# EAGLE design TRV_ANAREN_V0.5 (EAGLE 6.3)
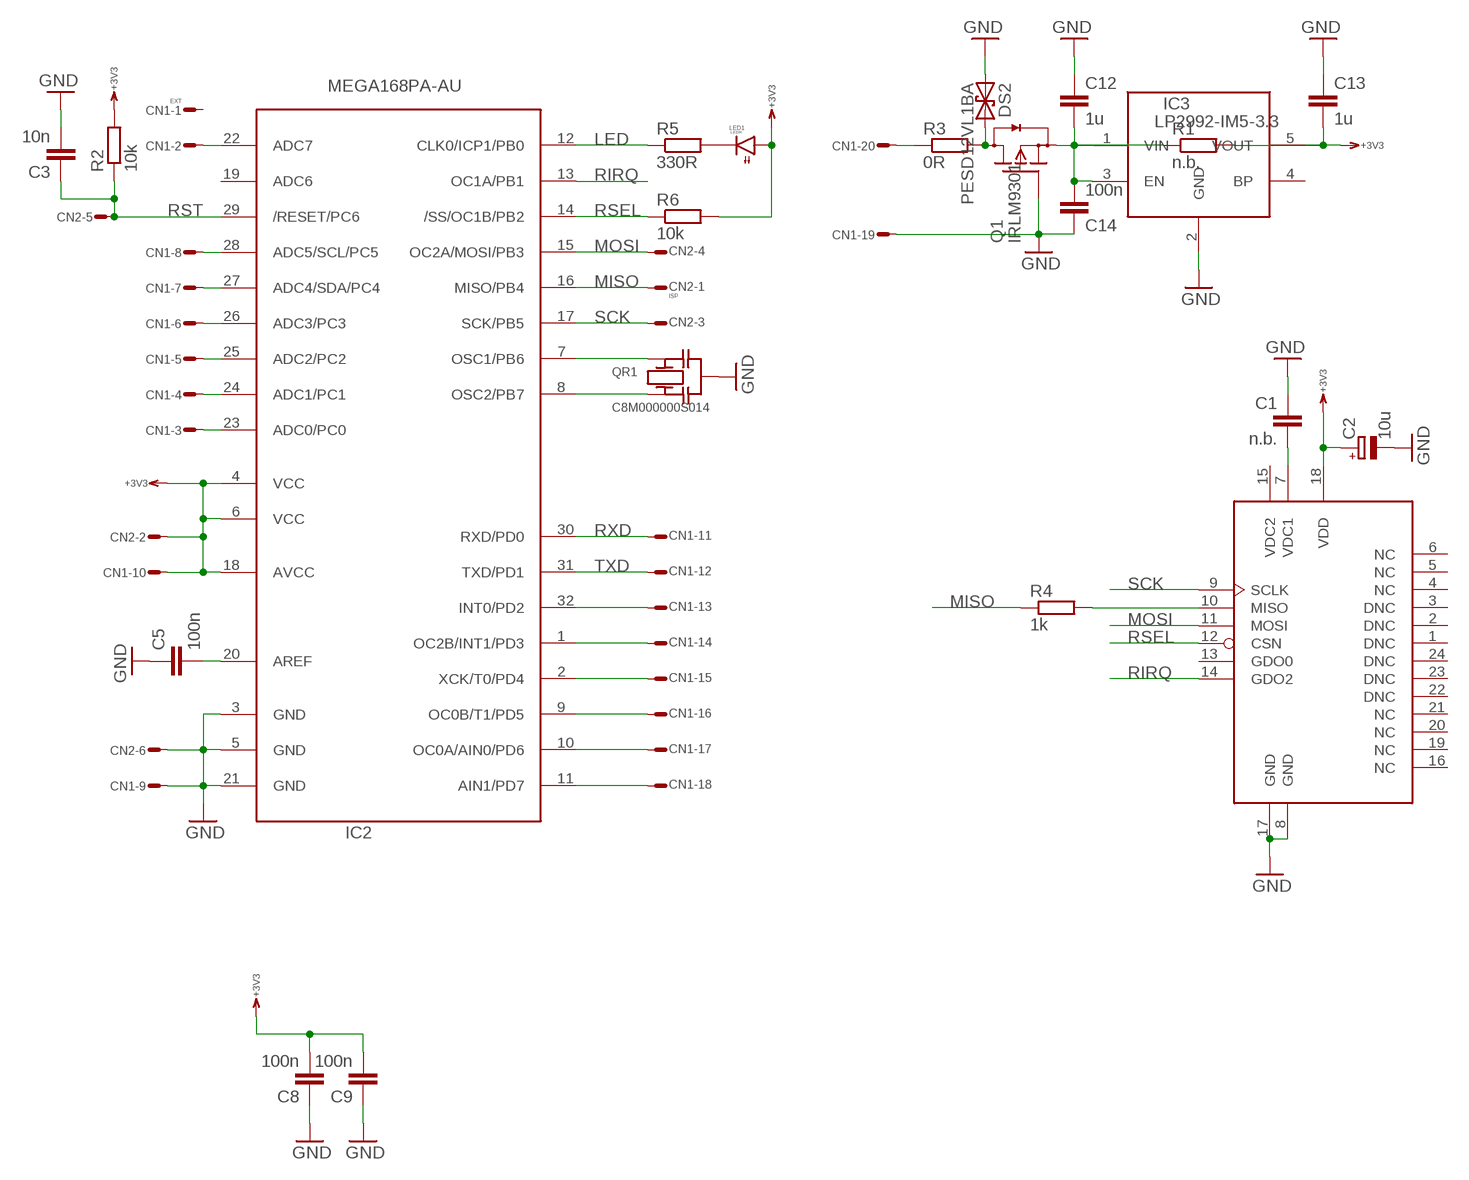
[diagram p0: schematic, sheet 1]

## Parts
C1  n.b.  C0603  [0603]
C2  10u  C_POLSMCB  [SMC_B]
C3  10n  C0603  [0603]
C5  100n  C0603  [0603]
C8  100n  C0603  [0603]
C9  100n  C0603  [0603]
C12  1u  C0603  [0603]
C13  1u  C0603  [0603]
C14  100n  C0603  [0603]
CN1  EXT  ML20SE  [ML20S]
CN2  ISP  ML6ES  [ML6S]
DS2  PESD12VL1BA  TVS-U323  [SOD323]
IC2  MEGA168PA-AU  MEGA168PA  [TQFP32-08]
IC3  LP2992-IM5-3.3  LDO  [SOT23-5]
LED1  LEDR  LED0603  [0603]
Q1  IRLM9301  FET-PDSOT23  [SOT23]
QR1  C8M000000S014  QRCR  [CR]
R1  n.b.  R0603  [0603]
R2  10k  R0603  [0603]
R3  0R  R0603  [0603]
R4  1k  R0603  [0603]
R5  330R  R0603  [0603]
R6  10k  R0603  [0603]
RF1  ANARENC  [ANAREN_C]

## Nets
+3V3: C2.+ C8.2 C9.2 C13.2 CN1.10 CN2.2 IC2.4(VCC) IC2.6(VCC) IC2.18(AVCC) IC3.5(VOUT) LED1.1(A) R1.2 R2.2 R6.2 RF1.18(VDD)
GND: C1.1 C2.- C3.2 C5.1 C8.1 C9.1 C12.1 C13.1 C14.1 CN1.9 CN1.19 CN2.6 DS2.A IC2.3(GND) IC2.5(GND) IC2.21(GND) IC3.2(GND) Q1.1(G) QR1.M RF1.8(GND) RF1.17(GND)
LED: IC2.12(CLK0/ICP1/PB0) R5.1
MISO: CN2.1 IC2.16(MISO/PB4) R4.1
MOSI: CN2.4 IC2.15(OC2A/MOSI/PB3) RF1.11(MOSI)
N$1: C1.2 RF1.7(VDC1)
N$2: R4.2 RF1.10(MISO)
N$3: CN1.2 IC2.22(ADC7)
N$5: DS2.C Q1.3(D) R3.2
N$6: C5.2 IC2.20(AREF)
N$12: C12.2 C14.2 IC3.1(VIN) IC3.3(EN) Q1.2(S) R1.1
N$18: IC2.7(OSC1/PB6) QR1.2
N$19: IC2.8(OSC2/PB7) QR1.1
N$21: LED1.2(C) R5.2
PC0: CN1.3 IC2.23(ADC0/PC0)
PC1: CN1.4 IC2.24(ADC1/PC1)
PC2: CN1.5 IC2.25(ADC2/PC2)
PC3: CN1.6 IC2.26(ADC3/PC3)
PC4: CN1.7 IC2.27(ADC4/SDA/PC4)
PC5: CN1.8 IC2.28(ADC5/SCL/PC5)
PD2: CN1.13 IC2.32(INT0/PD2)
PD3: CN1.14 IC2.1(OC2B/INT1/PD3)
PD4: CN1.15 IC2.2(XCK/T0/PD4)
PD5: CN1.16 IC2.9(OC0B/T1/PD5)
PD6: CN1.17 IC2.10(OC0A/AIN0/PD6)
PD7: CN1.18 IC2.11(AIN1/PD7)
RIRQ: IC2.13(OC1A/PB1) RF1.14(GDO2)
RSEL: IC2.14(/SS/OC1B/PB2) R6.1 RF1.12(CSN)
RST: C3.1 CN2.5 IC2.29(/RESET/PC6) R2.1
RXD: CN1.11 IC2.30(RXD/PD0)
SCK: CN2.3 IC2.17(SCK/PB5) RF1.9(SCLK)
TXD: CN1.12 IC2.31(TXD/PD1)
VIN: CN1.20 R3.1
Unconnected: CN1.1 IC2.19(ADC6) IC3.4(BP) RF1.1(DNC) RF1.2(DNC) RF1.3(DNC) RF1.4(NC) RF1.5(NC) RF1.6(NC) RF1.13(GDO0) RF1.15(VDC2) RF1.16(NC) RF1.19(NC) RF1.20(NC) RF1.21(NC) RF1.22(DNC) RF1.23(DNC) RF1.24(DNC)

## Library data of the parts
C1 C3 C5 C8 C9 C12-C14 = RCL:C: Capacitor SMD
C2 = RCL:C_POL: POLARIZED CAPACITOR, European symbol
CN1 = Conn:ML20?E: HARTING
CN2 = Conn:ML6E: HARTING
DS2 = Diode:TVS-U: DIODE
IC2 = atmel:MEGA168P: MCU, 4/8/16k, TQFP32
IC3 = DCDC:LDO
LED1 = Optic:LED
Q1 = Transistor:FET-PD
QR1 = QUARTZ:QR
R1-R6 = RCL:R: Resistor SMD
RF1 = RF:ANAREN

## Board
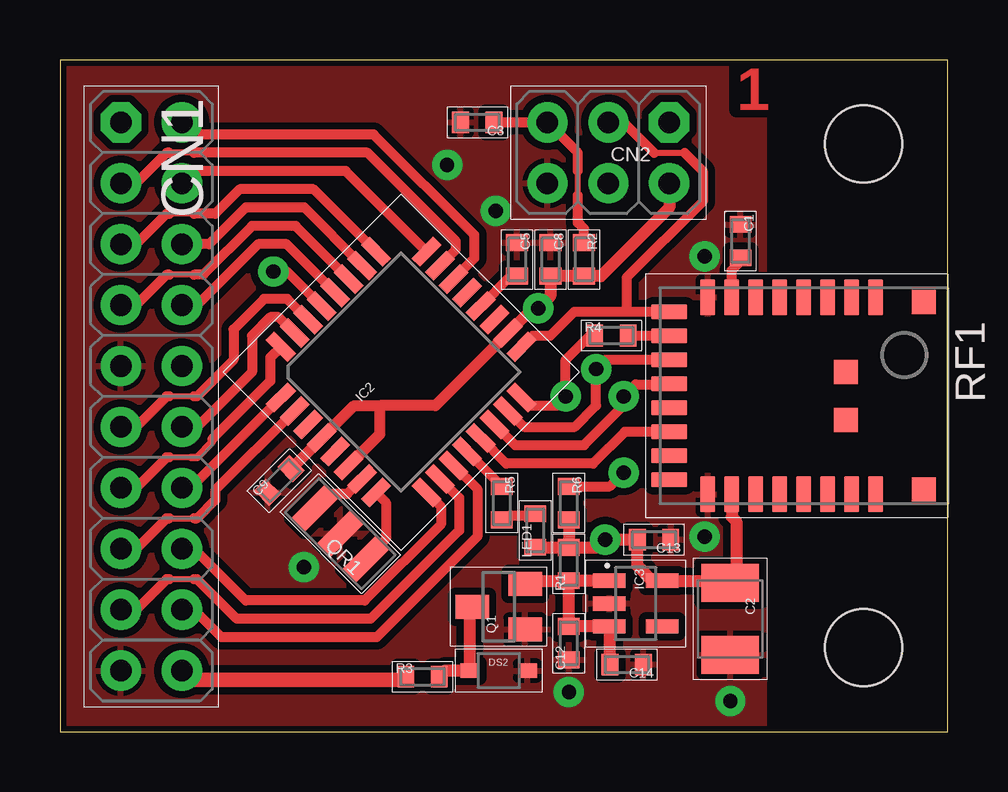
[diagram p1: board, top side]
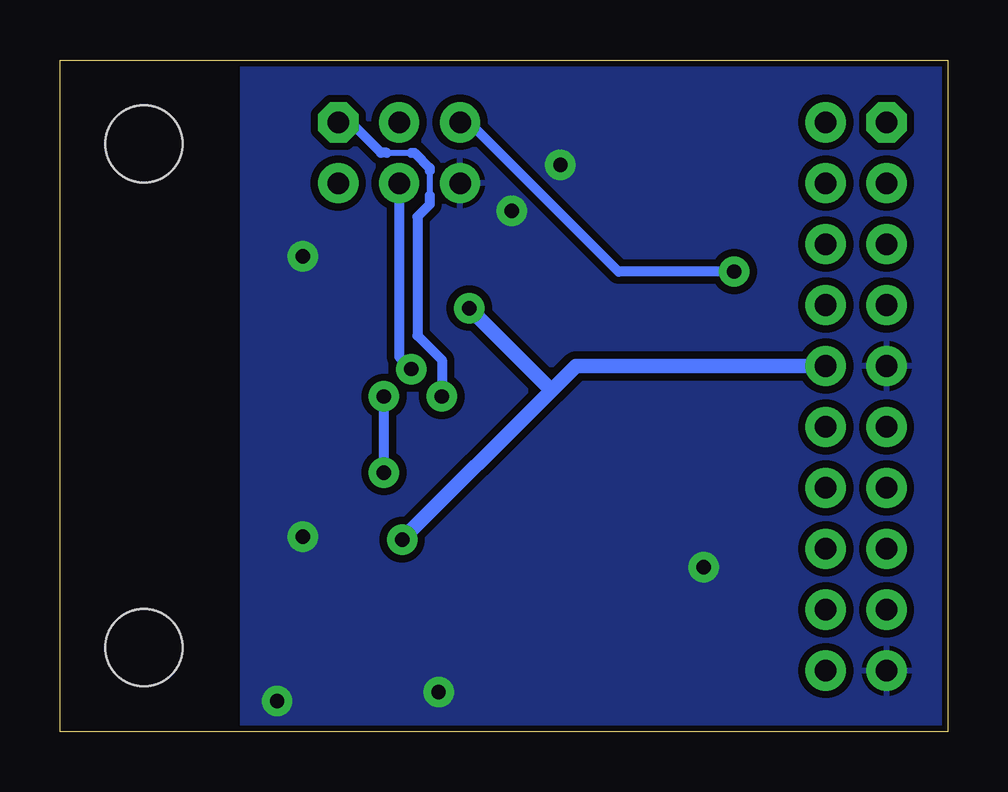
[diagram p2: board, bottom side, seen from below]

Size 37 x 28 mm. Coordinates in mm from the lower left corner, seen from the top.
Outline: 0,0 37,0 37,28 0,28 0,0
Copper layers (1*16): Top 0.035mm / dielectric 1.5mm / Bottom 0.035mm
Design rules "default *": minimum track width 8mil, minimum drill 0.3mm, track to track 12mil, track to pad 12mil, pad to pad 10mil, via to via 12mil, smd to smd 10mil, copper to edge 10mil, drill to drill 8mil, minimum pad ring 5mil, minimum via ring 8mil, stop-mask expansion 4mil, vias tented up to drill 25mil, thermal gap 8mil
Holes 3.2 mm at 33.5,24.5 33.5,3.5
tRestrict: area 26.3,10.8 to 27.7,17.3; area 10.4,14.9 to 10.7,15.1

### Footprints (pad centres in the part's own frame; a part is rotated, then mirrored left to right if it is on the bottom)
0603 = smd 0.7 x 0.9: 1 -0.697,0; 2 0.697,0
SMC_B = smd 1.6 x 2.4: + -1.5,0; - 1.5,0
ML20S = drill 0.9 pad 1.676 octagon: 1 -11.43,-1.27 | drill 0.9 pad 1.676: 2 -11.43,1.27; 3 -8.89,-1.27; 4 -8.89,1.27; 5 -6.35,-1.27; 6 -6.35,1.27; 7 -3.81,-1.27; 8 -3.81,1.27; 9 -1.27,-1.27; 10 -1.27,1.27; 11 1.27,-1.27; 12 1.27,1.27; 13 3.81,-1.27; 14 3.81,1.27; 15 6.35,-1.27; 16 6.35,1.27; 17 8.89,-1.27; 18 8.89,1.27; 19 11.43,-1.27; 20 11.43,1.27
ML6S = drill 0.9 pad 1.676 octagon: 1 -2.54,-1.27 | drill 0.9 pad 1.676: 2 -2.54,1.27; 3 0,-1.27; 4 0,1.27; 5 2.54,-1.27; 6 2.54,1.27
SOD323 = smd 0.8 x 0.6: A 1.2,0; C -1.2,0
TQFP32-08 = smd 1.27 x 0.5: 1 -4.293,2.8; 2 -4.293,2; 3 -4.293,1.2; 4 -4.293,0.4; 5 -4.293,-0.4; 6 -4.293,-1.2; 7 -4.293,-2; 8 -4.293,-2.8; 17 4.293,-2.8; 18 4.293,-2; 19 4.293,-1.2; 20 4.293,-0.4; 21 4.293,0.4; 22 4.293,1.2; 23 4.293,2; 24 4.293,2.8 | smd 0.5 x 1.27: 9 -2.8,-4.293; 10 -2,-4.293; 11 -1.2,-4.293; 12 -0.4,-4.293; 13 0.4,-4.293; 14 1.2,-4.293; 15 2,-4.293; 16 2.8,-4.293; 25 2.8,4.293; 26 2,4.293; 27 1.2,4.293; 28 0.4,4.293; 29 -0.4,4.293; 30 -1.2,4.293; 31 -2,4.293; 32 -2.8,4.293
SOT23-5 = smd 0.6 x 1.35: 1 -0.95,-1.101; 2 0,-1.101; 3 0.95,-1.101; 4 0.95,1.101; 5 -0.951,1.101
SOT23 = smd 1 x 1.4: 1 -0.95,-1.1; 2 0.95,-1.1; 3 0,1.1
CR = smd 0.8 x 2: 1 -1.5,0; 2 1.5,0; M 0,0
ANAREN_C = smd 1.5 x 0.61: 1 -4.11,2.6; 2 -4.11,1.6; 3 -4.11,0.6; 4 -4.11,-0.4; 5 -4.11,-1.4; 6 -4.11,-2.4; 7 -4.11,-3.4; 8 -4.11,-4.4; 17 4.11,-4.4; 18 4.11,-3.4; 19 4.11,-2.4; 20 4.11,-1.4; 21 4.11,-0.4; 22 4.11,0.6; 23 4.11,1.6; 24 4.11,2.6 | smd 0.61 x 1.5: 9 -3.5,-6; 10 -2.5,-6; 11 -1.5,-6; 12 -0.5,-6; 13 0.5,-6; 14 1.5,-6; 15 2.5,-6; 16 3.5,-6 | smd 1 x 1: PL2 -3.91,4.6; PL3 3.91,4.6; PL4 -1,1.35; PL5 1,1.35

### Placement (x,y rotation side)
C1  28.37,20.45 270 top
C2  27.94,4.7 270 top
C3  17.4,25.4 180 top
C5  19.05,19.68 270 top
C8  20.45,19.68 270 top
C9  9.14,10.46 45 top
C12  21.21,3.68 90 top
C13  24.77,8 180 top
C14  23.63,2.79 180 top
CN1  3.81,13.97 270 top
CN2  22.86,24.13 180 top
DS2  18.29,2.54 0 top
IC2  14.22,14.99 45 top
IC3  24,5.33 270 top
LED1  19.81,8.38 90 top
Q1  18.29,5.21 90 top
QR1  11.68,8.26 135 top
R1  21.21,6.99 90 top
R2  21.84,19.68 270 top
R3  15.11,2.29 0 top
R4  22.99,16.51 0 top
R5  18.41,9.53 270 top
R6  21.21,9.53 270 top
RF1  31.4,14 270 top

### Tracks (layer width: path | path; a pad name or v marks a point on that pad's centre or on a via)
+3V3  (via drill 0.6 pad 1.27)
  Top 0.406: IC2.4
  Top 0.457: C9.2 IC2.4 | IC2.4 12.26,13.59 13.34,13.59 | IC2.6 13.34,12.4 13.34,13.59 | 13.34,13.59 15.65,13.59 IC2.18 19.72,17.65 v19.94,17.65
  Top 0.508: RF1.18 28,8.96 28.19,8.76 28.19,6.45 C2.+ 27.85,6.29 IC3.5 24.7,6.29 24.07,6.92 C13.2 v22.73,8 22.41,7.68 R1.2 | CN2.2 25.4,21.84 22.54,18.99 R2.2 C8.2 20.45,18.16 v19.94,17.65 | LED1.1 R1.2 | R6.2 R1.2
  Bottom 0.61: CN1.10 15.49,15.24 16.51,14.22 | v22.73,8 16.51,14.22 | v19.94,17.65 16.51,14.22
GND  (via drill 0.6 pad 1.27)
  other vias: 10.17,6.86 26.87,8.13 26.87,19.81 27.95,1.27 18.17,21.71 16.14,23.62 21.22,1.65
  pour Top: 0,0 29.36,0 29.36,28 0,28
  pour Bottom: 0,0 29.36,0 29.36,28 0,28
LED
  Top 0.406: IC2.12 R5.1
MISO  (via drill 0.6 pad 1.27)
  Top 0.406: R4.1 22.1,16.51 21.08,15.49 v21.08,13.97 20.7,13.59 19.58,13.59 IC2.16
  Bottom 0.254: 23.37,24.13 22.35,24.13 | 21.59,23.37 21.59,22.35
  Bottom 0.406: 22.35,24.13 22.23,24.13 21.59,23.5 21.59,23.37 | v21.08,13.97 21.08,15.49 22.1,16.51 22.1,21.46 21.59,21.97 21.59,22.35 | 23.37,24.13 23.62,24.13 24.89,25.4 CN2.1
MOSI  (via drill 0.6 pad 1.27)
  Top 0.406: IC2.15 19.34,12.7 21.46,12.7 22.35,13.59 v22.35,15.11 22.74,15.5 RF1.11
  Bottom 0.406: CN2.4 22.86,15.62 v22.35,15.11
N$1
  Top 0.406: RF1.7 28,19.24 28.32,19.56 28.32,19.7 C1.2
N$2
  Top 0.406: RF1.10 23.69,16.5 R4.2
N$3
  Top 0.406: IC2.22 17.27,19.73 17.27,20.7 13.08,24.89 5.59,24.89 CN1.2
N$5
  Top 0.508: Q1.3 17.09,5.11 DS2.C 16.06,2.54 R3.2
N$6
  Top 0.406: IC2.20 18.79,18.99 C5.2
N$12
  Top 0.406: IC3.1 23.31,6.28 | R1.1
  Top 0.508: C12.2 | C14.2 22.93,4.35 IC3.3 C12.2 | IC3.1 R1.1 | Q1.2 19.52,6.28 R1.1 | C12.2 R1.1
N$18
  Top 0.406: IC2.7 11.97,9.91 11.3,9.91 10.71,9.32 QR1.2
N$19
  Top 0.406: IC2.8 13.59,9.55 13.59,8.04 QR1.1
N$21
  Top 0.406: R5.2 18.41,8.89 18.67,8.89 18.8,9.02 19.75,9.02 LED1.2
PC0
  Top 0.254: 5.59,24.13 4.57,24.13
  Top 0.406: IC2.23 16.51,20.1 16.51,20.45 12.83,24.13 5.59,24.13 | 4.57,24.13 4.45,24.13 3.17,22.86 CN1.3
PC1
  Top 0.406: IC2.24 11.91,23.37 5.59,23.37 CN1.4
PC2
  Top 0.254: 5.59,21.59 4.57,21.59
  Top 0.406: 4.57,21.59 4.45,21.59 3.17,20.32 CN1.5 | IC2.25 10.56,22.61 7.49,22.61 6.48,21.59 5.59,21.59
PC3
  Top 0.406: IC2.26 10.19,21.84 7.75,21.84 6.22,20.32 CN1.6
PC4
  Top 0.254: 5.59,19.05 4.57,19.05
  Top 0.406: 4.57,19.05 4.45,19.05 3.17,17.78 CN1.7 | IC2.27 9.82,21.08 8,21.08 5.97,19.05 5.59,19.05
PC5
  Top 0.406: IC2.28 9.46,20.32 8.26,20.32 5.71,17.78 CN1.8
PD2
  Top 0.254: 5.46,11.43 4.57,11.43
  Top 0.305: 5.46,11.43 5.71,11.43 6.35,12.06 6.35,12.19
  Top 0.406: 4.57,11.43 4.45,11.43 3.17,10.16 CN1.13 | 6.35,12.19 8.76,14.61 8.76,15.6 IC2.32
PD3
  Top 0.406: IC2.1 5.44,10.16 CN1.14
PD4
  Top 0.254: 4.57,8.89 5.59,8.89
  Top 0.406: IC2.2 6.48,10.07 6.48,9.65 5.71,8.89 5.59,8.89 | CN1.15 3.17,7.62 4.45,8.89 4.57,8.89
PD5
  Top 0.406: CN1.16 5.59,7.62 7.75,5.46 12.7,5.46 15.88,8.64 15.88,9.38 IC2.9
PD6
  Top 0.254: 5.59,6.35 4.57,6.35
  Top 0.406: 5.59,6.35 5.71,6.35 7.37,4.7 12.95,4.7 16.64,8.38 16.64,9.74 IC2.10 | 4.57,6.35 4.45,6.35 3.17,5.08 CN1.17
PD7
  Top 0.406: CN1.18 5.59,5.08 6.73,3.94 13.21,3.94 17.4,8.13 17.4,10.11 IC2.11
RIRQ
  Top 0.406: IC2.13 18.6,11.18 22.23,11.18 23.55,12.5 RF1.14
RSEL  (via drill 0.6 pad 1.27)
  Top 0.406: IC2.14 18.97,11.94 21.84,11.94 23.5,13.59 v23.5,13.97 24,14.48 25.38,14.48 RF1.12 | R6.1 22.92,10.22 v23.5,10.79
  Bottom 0.406: v23.5,10.79 v23.5,13.97
RST  (via drill 0.6 pad 1.27)
  Top 0.254: 21.59,22.35 21.59,23.37
  Top 0.406: IC2.29 9.47,19.18 v8.89,19.18 | 21.59,23.37 21.59,24.13 CN2.5 C3.1 | R2.1 21.84,20.95 21.59,21.21 21.59,22.35
  Bottom 0.406: v8.89,19.18 13.72,19.18 19.94,25.4 CN2.5
RXD
  Top 0.254: 5.59,13.97 4.57,13.97
  Top 0.406: 4.57,13.97 4.45,13.97 3.17,12.7 CN1.11 | IC2.30 9.48,18.03 8.51,18.03 7.24,16.76 7.24,15.49 5.71,13.97 5.59,13.97
SCK
  Top 0.254: 24.77,24.13 26.04,24.13
  Top 0.406: CN2.3 23.5,25.4 24.77,24.13 | 26.04,24.13 26.8,23.37 26.8,22.1 23.62,18.92 23.62,17.5 | RF1.9 23.62,17.5 | 23.62,17.5 21.44,17.5 20.45,16.51 19.71,16.51 IC2.17
TXD
  Top 0.406: IC2.31 9.11,17.27 8.76,17.27 8,16.51 8,14.99 5.71,12.7 CN1.12
VIN
  Top 0.61: CN1.20 5.46,2.16 14.29,2.16 R3.1

### Text on the board
Top: 1